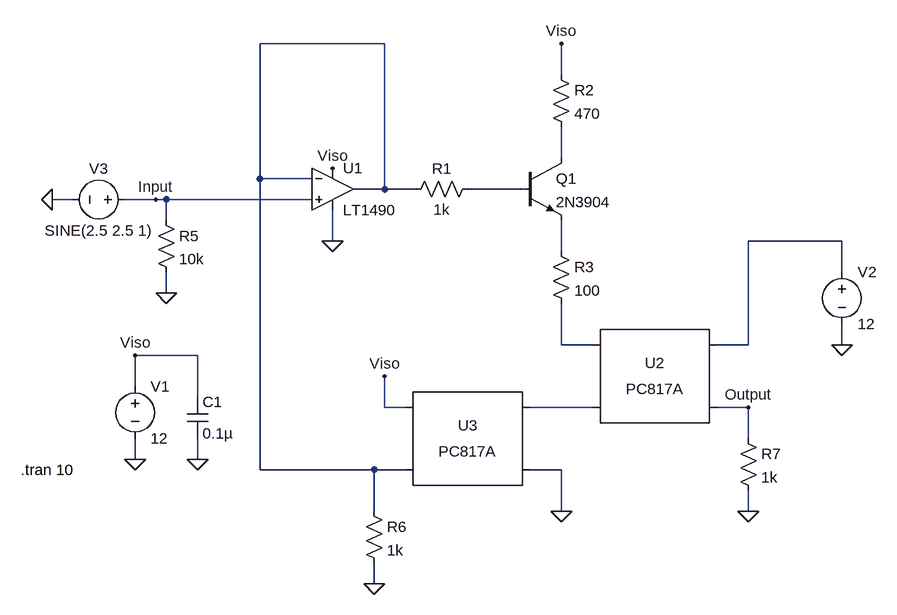
[diagram p0: schematic AnalogOpto test.asc]
AnalogOpto test.asc, the LTspice schematic file:
Version 4
SHEET 1 1232 760
WIRE 256 -112 64 -112
WIRE 528 -64 528 -112
WIRE 528 64 528 16
WIRE 64 96 64 -112
WIRE 144 96 64 96
WIRE 256 112 256 -112
WIRE 256 112 208 112
WIRE 304 112 256 112
WIRE 464 112 384 112
WIRE -224 128 -256 128
WIRE -96 128 -144 128
WIRE -80 128 -96 128
WIRE 144 128 -80 128
WIRE -80 160 -80 128
WIRE 176 192 176 144
WIRE 960 192 816 192
WIRE 528 208 528 160
WIRE 960 240 960 192
WIRE -80 272 -80 240
WIRE 528 352 528 288
WIRE 576 352 528 352
WIRE 816 352 816 192
WIRE 816 352 768 352
WIRE 960 352 960 320
WIRE -32 368 -128 368
WIRE -128 416 -128 368
WIRE -32 432 -32 368
WIRE 256 448 256 400
WIRE 288 448 256 448
WIRE 576 448 480 448
WIRE 816 448 768 448
WIRE 816 496 816 448
WIRE -128 528 -128 496
WIRE -32 528 -32 496
WIRE 64 544 64 96
WIRE 240 544 64 544
WIRE 288 544 240 544
WIRE 528 544 480 544
WIRE 240 608 240 544
WIRE 528 608 528 544
WIRE 816 608 816 576
WIRE 240 720 240 688
FLAG 176 192 0
FLAG -128 528 0
FLAG -32 528 0
FLAG 528 608 0
FLAG 816 608 0
FLAG -80 272 0
FLAG 240 720 0
FLAG 960 352 0
FLAG 816 448 Output
FLAG -256 128 0
FLAG -96 128 Input
FLAG 256 400 Viso
FLAG 176 80 Viso
FLAG -128 368 Viso
FLAG 528 -112 Viso
SYMBOL voltage -128 400 R0
WINDOW 123 0 0 Left 0
WINDOW 39 0 0 Left 0
SYMATTR InstName V1
SYMATTR Value 12
SYMBOL cap -48 432 R0
SYMATTR InstName C1
SYMATTR Value 0.1µ
SYMBOL res 400 96 R90
WINDOW 0 0 56 VBottom 2
WINDOW 3 32 56 VTop 2
SYMATTR InstName R1
SYMATTR Value 1k
SYMBOL npn 464 64 R0
SYMATTR InstName Q1
SYMATTR Value 2N3904
SYMBOL res 512 -80 R0
SYMATTR InstName R2
SYMATTR Value 470
SYMBOL res 512 192 R0
SYMATTR InstName R3
SYMATTR Value 100
SYMBOL Optos\\PC817A 672 400 R0
SYMATTR InstName U2
SYMBOL Optos\\PC817A 384 496 M0
SYMATTR InstName U3
SYMBOL res -96 144 R0
SYMATTR InstName R5
SYMATTR Value 10k
SYMBOL res 224 592 R0
SYMATTR InstName R6
SYMATTR Value 1k
SYMBOL voltage 960 224 R0
WINDOW 123 0 0 Left 0
WINDOW 39 0 0 Left 0
SYMATTR InstName V2
SYMATTR Value 12
SYMBOL res 800 480 R0
SYMATTR InstName R7
SYMATTR Value 1k
SYMBOL voltage -128 128 R90
WINDOW 0 -32 56 VBottom 2
WINDOW 3 32 56 VTop 2
WINDOW 123 0 0 Left 0
WINDOW 39 0 0 Left 0
SYMATTR InstName V3
SYMATTR Value SINE(2.5 2.5 1)
SYMBOL Opamps\\LT1490 176 48 R0
SYMATTR InstName U1
TEXT -304 544 Left 2 !.tran 10

The netlist it stands for:
* AnalogOpto test.asc
V1 Viso 0 12
C1 Viso 0 0.1µ
R1 N003 N001 1k
Q1 N002 N003 N005 0 2N3904
R2 Viso N002 470
R3 N005 N006 100
XU2 N006 N007 N004 Output PC817 Igain=1m
XU3 N007 0 Viso N001 PC817 Igain=1m
R5 Input 0 10k
R6 N001 0 1k
V2 N004 0 12
R7 Output 0 1k
V3 Input 0 SINE(2.5 2.5 1)
XU1 Input N001 Viso 0 N001 LT1490  ; pins In+ In- V+ V- OUT
.model NPN NPN
.model PNP PNP
.lib standard.bjt
.tran 10
.lib PC817.sub
.backanno
.end